# EAGLE design primary_teensy (EAGLE 6.1)
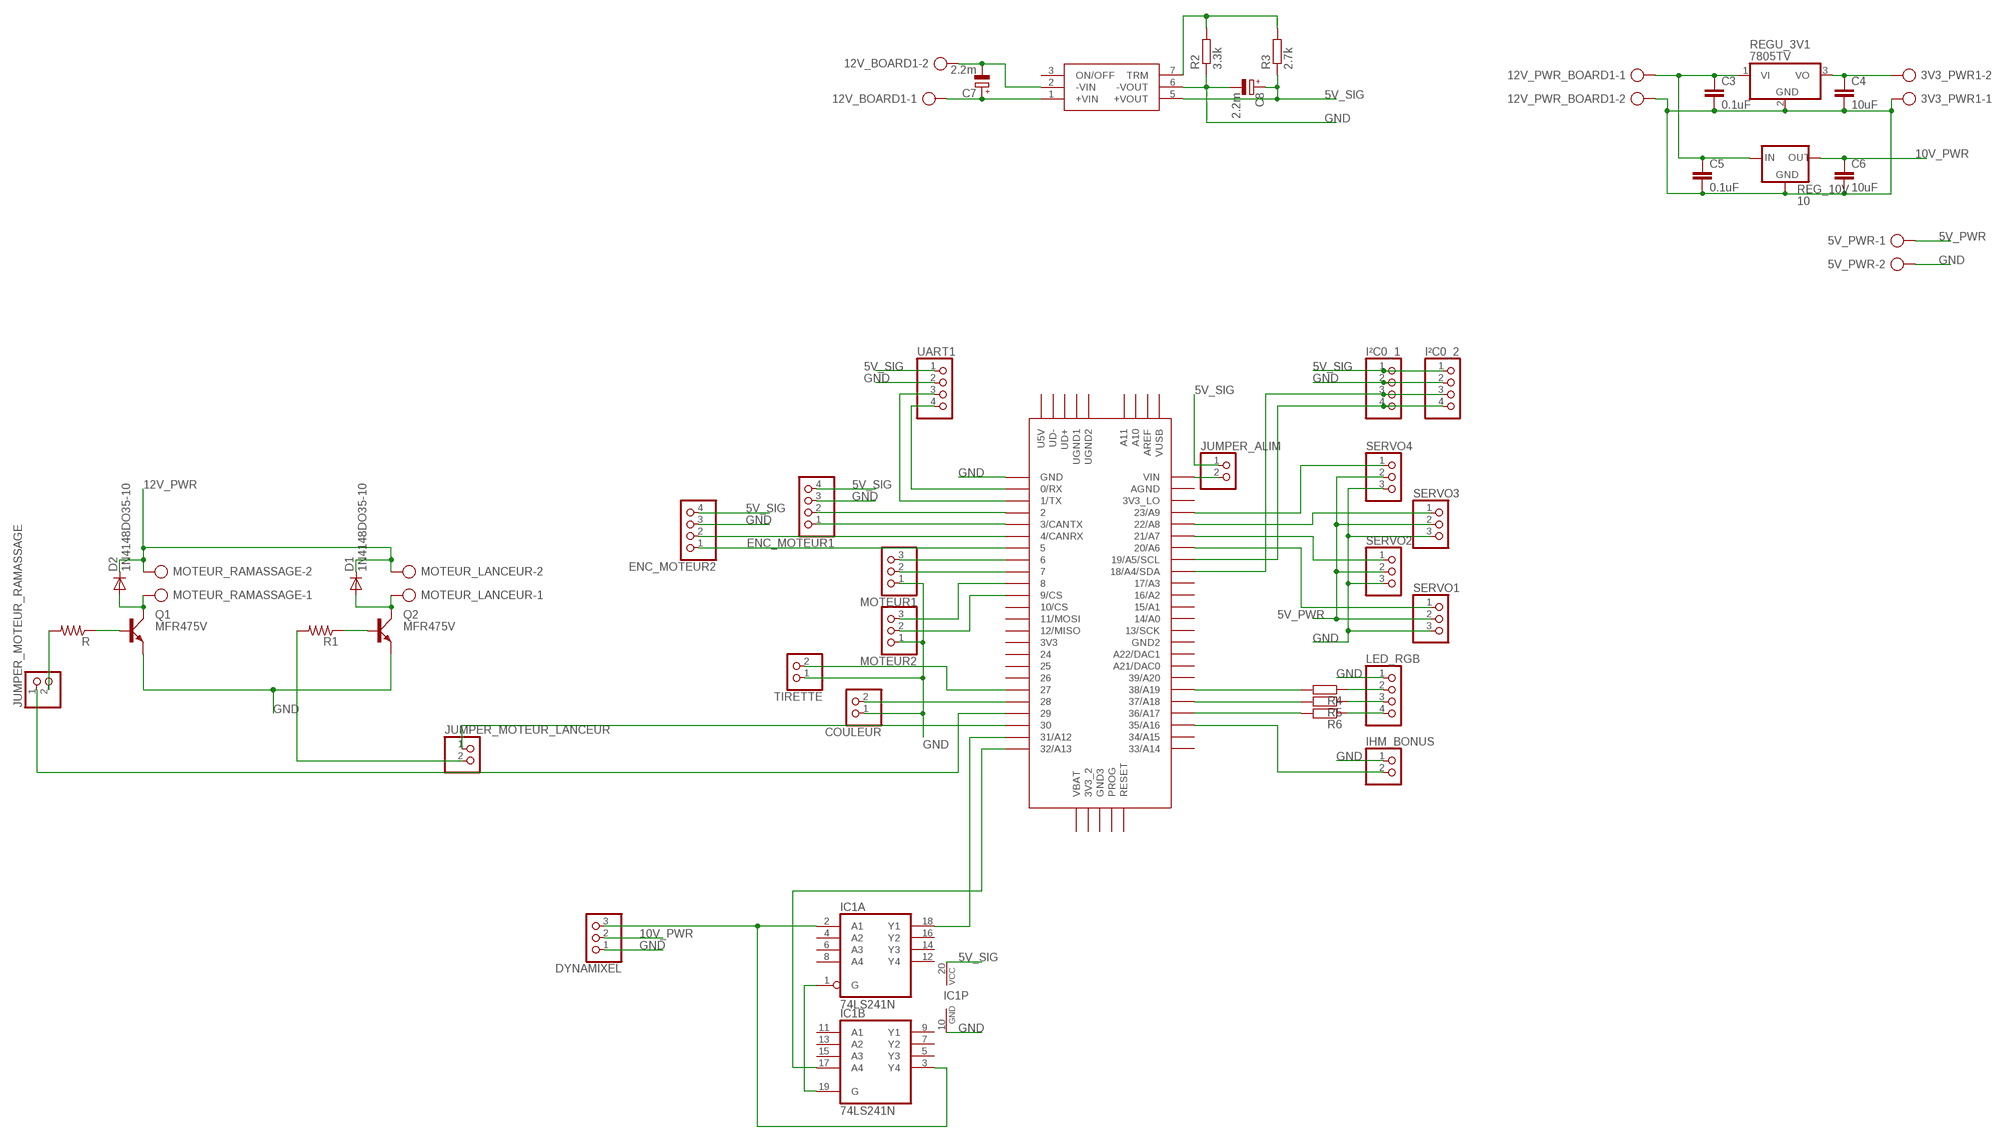
[diagram p0: schematic, sheet 1]

## Parts
3V3_PWR1  AK300/2  [AK300/2]
5V_PWR  AK300/2  [AK300/2]
12V_BOARD1  AK300/2  [AK300/2]
12V_PWR_BOARD1  AK300/2  [AK300/2]
C3  0.1uF  C-EU050-025X075  [C050-025X075]
C4  10uF  C-EU050-025X075  [C050-025X075]
C5  0.1uF  C-EU050-025X075  [C050-025X075]
C6  10uF  C-EU050-025X075  [C050-025X075]
C7  2.2m  CPOL-EUE5-13  [E5-13]
C8  2.2m  CPOL-EUE5-13  [E5-13]
COULEUR  PINHD-1X2  [1X02]
D1  1N4148DO35-10  [DO35-10]
D2  1N4148DO35-10  [DO35-10]
DYNAMIXEL  PINHD-1X3  [1X03]
ENC_MOTEUR1  PINHD-1X4  [1X04]
ENC_MOTEUR2  PINHD-1X4  [1X04]
IC1  74LS241N  [DIL20]
IHM_BONUS  PINHD-1X2  [1X02]
I²C0_1  PINHD-1X4  [1X04]
I²C0_2  PINHD-1X4  [1X04]
JUMPER_ALIM  PINHD-1X2  [1X02]
JUMPER_MOTEUR_LANCEUR  PINHD-1X2  [1X02]
JUMPER_MOTEUR_RAMASSAGE  PINHD-1X2  [1X02]
LED_RGB  PINHD-1X4  [1X04]
MOTEUR1  PINHD-1X3  [1X03]
MOTEUR2  PINHD-1X3  [1X03]
MOTEUR_LANCEUR  AK300/2  [AK300/2]
MOTEUR_RAMASSAGE  AK300/2  [AK300/2]
Q1  MFR475V  [TO220AV]
Q2  MFR475V  [TO220AV]
R  RESISTORAXIAL-0.3  [AXIAL-0.3]
R1  RESISTORAXIAL-0.3  [AXIAL-0.3]
R2  3.3k  R-EU_0207/7  [0207/7]
R3  2.7k  R-EU_0207/7  [0207/7]
R4  R-EU_0207/7  [0207/7]
R5  R-EU_0207/7  [0207/7]
R6  R-EU_0207/7  [0207/7]
REG_10V  10  78XXS  [78XXS]
REGU_3V1  7805TV  [TO220V]
SERVO1  PINHD-1X3  [1X03]
SERVO2  PINHD-1X3  [1X03]
SERVO3  PINHD-1X3  [1X03]
SERVO4  PINHD-1X3  [1X03]
TIRETTE  PINHD-1X2  [1X02]
U$1  TEENSY_3.5/3.6  [TEENSY_3.5/3.6]
U$3  TEN25-1211TEN25-1211  [TEN25]
UART1  PINHD-1X4  [1X04]

## Nets
3V3: 3V3_PWR1.2 C4.1 REGU_3V1.3(VO)
5V_PWR: 5V_PWR.1 SERVO1.2 SERVO2.2 SERVO3.2 SERVO4.2
5V_SIG: C8.+ ENC_MOTEUR1.4 ENC_MOTEUR2.4 IC1.20(P:VCC) I²C0_1.1 I²C0_2.1 JUMPER_ALIM.1 R3.1 U$3.5(+VOUT) UART1.1
10V_PWR: C6.1 DYNAMIXEL.2 REG_10V.OUT
12V_PWR: 12V_PWR_BOARD1.1 C3.1 C5.1 D1.C D2.C MOTEUR_LANCEUR.2 MOTEUR_RAMASSAGE.2 REG_10V.IN REGU_3V1.1(VI)
+12V: 12V_BOARD1.1 C7.+ U$3.1(+VIN)
ENC_MOT1_A: ENC_MOTEUR1.2 U$1.2
ENC_MOT1_B: ENC_MOTEUR1.1 U$1.3/CANTX
ENC_MOT2_A: ENC_MOTEUR2.2 U$1.4/CANRX
ENC_MOT2_B: ENC_MOTEUR2.1 U$1.5
GND: 3V3_PWR1.1 5V_PWR.2 12V_PWR_BOARD1.2 C3.2 C4.2 C5.2 C6.2 C8.- COULEUR.1 DYNAMIXEL.1 ENC_MOTEUR1.3 ENC_MOTEUR2.3 IC1.10(P:GND) IHM_BONUS.1 I²C0_1.2 I²C0_2.2 LED_RGB.1 MOTEUR1.1 MOTEUR2.1 Q1.E Q2.E R2.1 REG_10V.GND REGU_3V1.2(GND) SERVO1.3 SERVO2.3 SERVO3.3 SERVO4.3 TIRETTE.1 U$1.GND U$3.6(-VOUT) UART1.2
GND_12: 12V_BOARD1.2 C7.- U$3.2(-VIN)
MOT1_DIR: MOTEUR1.3 U$1.6
MOT1_PWM: MOTEUR1.2 U$1.7
MOT2_DIR: MOTEUR2.3 U$1.8
MOT2_PWM: MOTEUR2.2 U$1.9/CS
MOT_LANCEUR: JUMPER_MOTEUR_LANCEUR.1 U$1.30
MOT_RAMASSAGE: JUMPER_MOTEUR_RAMASSAGE.1 U$1.29
N$1: D2.A MOTEUR_RAMASSAGE.1 Q1.C
N$2: D1.A MOTEUR_LANCEUR.1 Q2.C
N$3: LED_RGB.4 R6.1
N$4: R2.2 R3.2 U$3.7(TRM)
N$5: Q2.B R1.P$1
N$6: Q1.B R.P$1
N$7: LED_RGB.3 R5.1
N$8: JUMPER_MOTEUR_LANCEUR.2 R1.P$2
N$9: JUMPER_MOTEUR_RAMASSAGE.2 R.P$2
N$10: SERVO4.1 U$1.23/A9
N$11: LED_RGB.2 R4.1
N$12: SERVO3.1 U$1.22/A8
N$13: SERVO2.1 U$1.21/A7
N$14: SERVO1.1 U$1.20/A6
N$15: JUMPER_ALIM.2 U$1.VIN
N$16: COULEUR.2 U$1.28
N$17: R4.2 U$1.38/A19
N$18: R5.2 U$1.37/A18
N$19: R6.2 U$1.36/A17
N$20: IHM_BONUS.2 U$1.35/A16
N$39: I²C0_1.3 I²C0_2.3 U$1.18/A4/SDA
N$40: I²C0_1.4 I²C0_2.4 U$1.19/A5/SCL
N$41: TIRETTE.2 U$1.27
N$44: IC1.1(A:G) IC1.19(B:G)
N$45: DYNAMIXEL.3 IC1.2(A:A1) IC1.3(B:Y4)
RX0: U$1.0/RX UART1.4
RX4: IC1.18(A:Y1) U$1.31/A12
TX1: U$1.1/TX UART1.3
TX4: IC1.17(B:A4) U$1.32/A13
Unconnected: IC1.4(A:A2) IC1.5(B:Y3) IC1.6(A:A3) IC1.7(B:Y2) IC1.8(A:A4) IC1.9(B:Y1) IC1.11(B:A1) IC1.12(A:Y4) IC1.13(B:A2) IC1.14(A:Y3) IC1.15(B:A3) IC1.16(A:Y2) U$1.3V3 U$1.3V3_2 U$1.3V3_LO U$1.10/CS U$1.11/MOSI U$1.12/MISO U$1.13/SCK U$1.14/A0 U$1.15/A1 U$1.16/A2 U$1.17/A3 U$1.21/DAC0(A21/DAC0) U$1.24 U$1.25 U$1.26 U$1.33/A14 U$1.34/A15 U$1.39/A20 U$1.A10 U$1.A11 U$1.A22/DAC1 U$1.AGND U$1.AREF U$1.GND2 U$1.GND3 U$1.PROG U$1.RESET U$1.U5V U$1.UD+ U$1.UD- U$1.UGND1 U$1.UGND2 U$1.VBAT U$1.VUSB U$3.3(ON/OFF)

## Library data of the parts
3V3_PWR1 5V_PWR 12V_BOARD1 12V_PWR_BOARD1 MOTEUR_LANCEUR MOTEUR_RAMASSAGE = con-ptr500:AK300/2: CONNECTOR; OC_FARNELL: unknown; OC_NEWARK: unknown
C3-C6 = rcl:C-EU: CAPACITOR, European symbol
C7 C8 = resistor:CPOL-EU: POLARIZED CAPACITOR, European symbol
COULEUR IHM_BONUS JUMPER_ALIM JUMPER_MOTEUR_LANCEUR JUMPER_MOTEUR_RAMASSAGE TIRETTE = pinhead:PINHD-1X2: PIN HEADER
D1 D2 = diode:1N4148: DIODE high speed (Philips)
DYNAMIXEL MOTEUR1 MOTEUR2 SERVO1-SERVO4 = pinhead:PINHD-1X3: PIN HEADER
ENC_MOTEUR1 ENC_MOTEUR2 I²C0_1 I²C0_2 LED_RGB UART1 = pinhead:PINHD-1X4: PIN HEADER
IC1 = 74xx-eu:74*241: Octal BUFFER and LINE DRIVER, 3-state
Q1 Q2 = transistor-power:MFR4*: NPN RF Power Transistor Source: Motorola - MRF475.pdf
R R1 = SparkFun:RESISTOR: Resistor Basic schematic elements and footprints for 0603, 1206, and PTH resistors.
R2-R6 = resistor:R-EU_: RESISTOR, European symbol
REG_10V = v-reg:78XXS: VOLTAGE REGULATOR
REGU_3V1 = linear:78*: Positive VOLTAGE REGULATOR Source: http://cache.national.com/ds/LM/LM78L05.pdf http://www.fairchildsemi.com/ds/LM/LM7805.pdf
U$1 = Teensy356:TEENSY_3.5/3.6
U$3 = tracopower:TEN25-1211

## Board
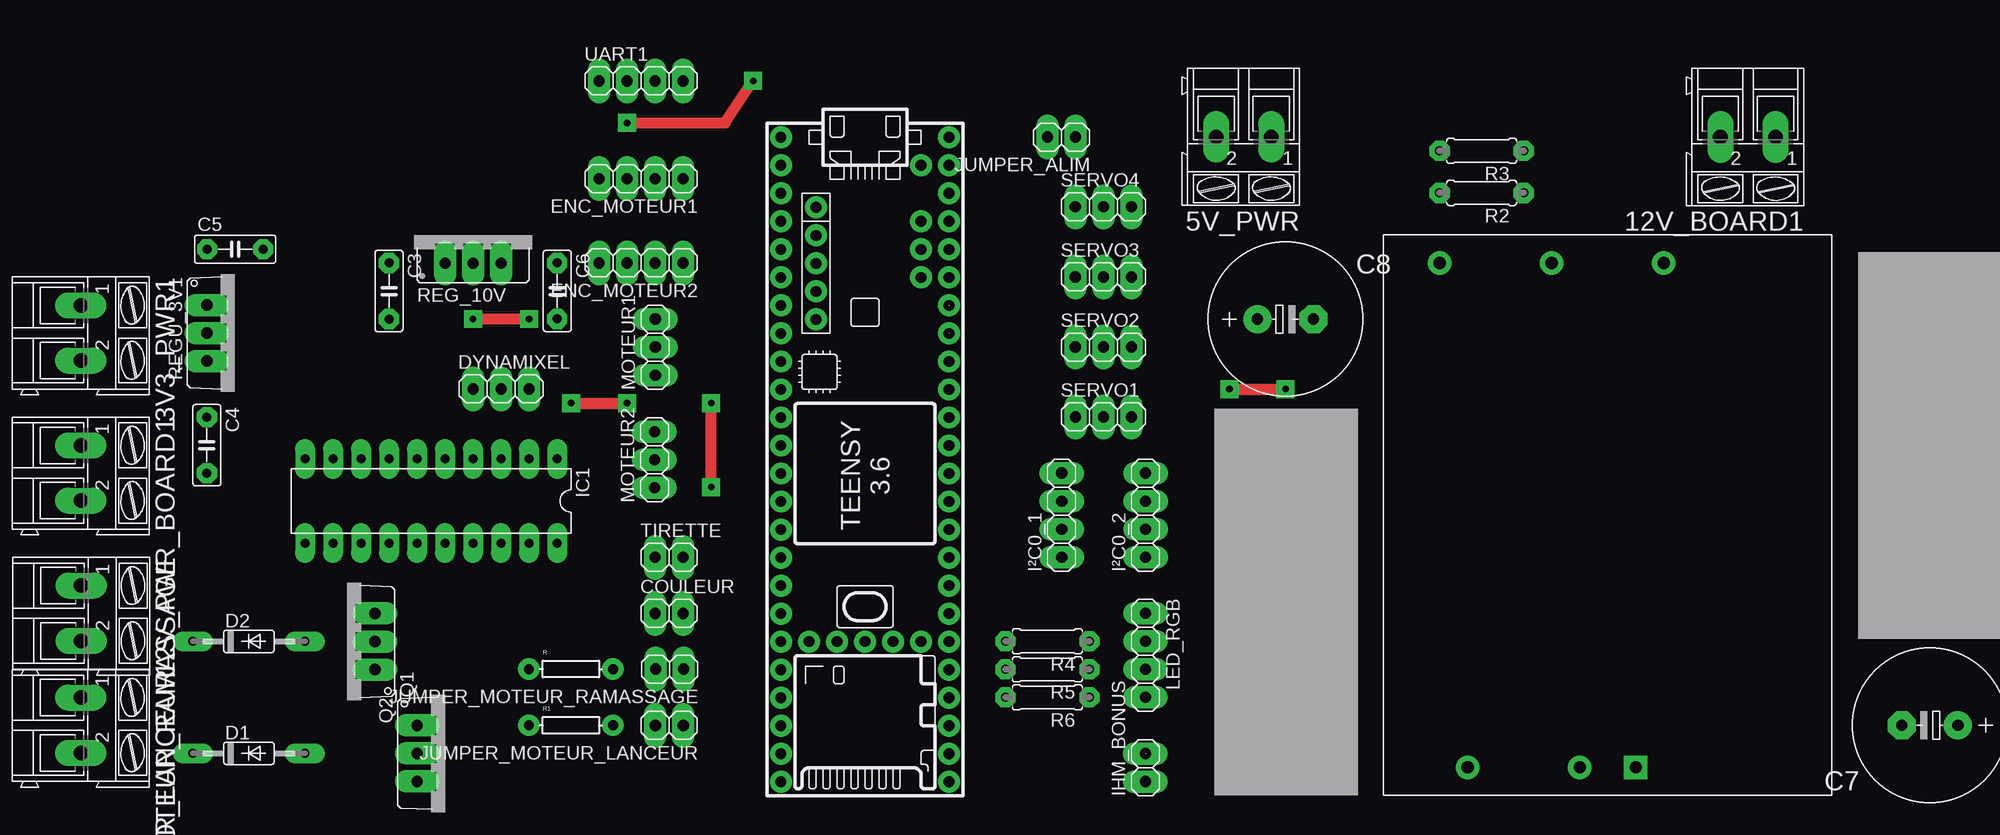
[diagram p1: board, top side]
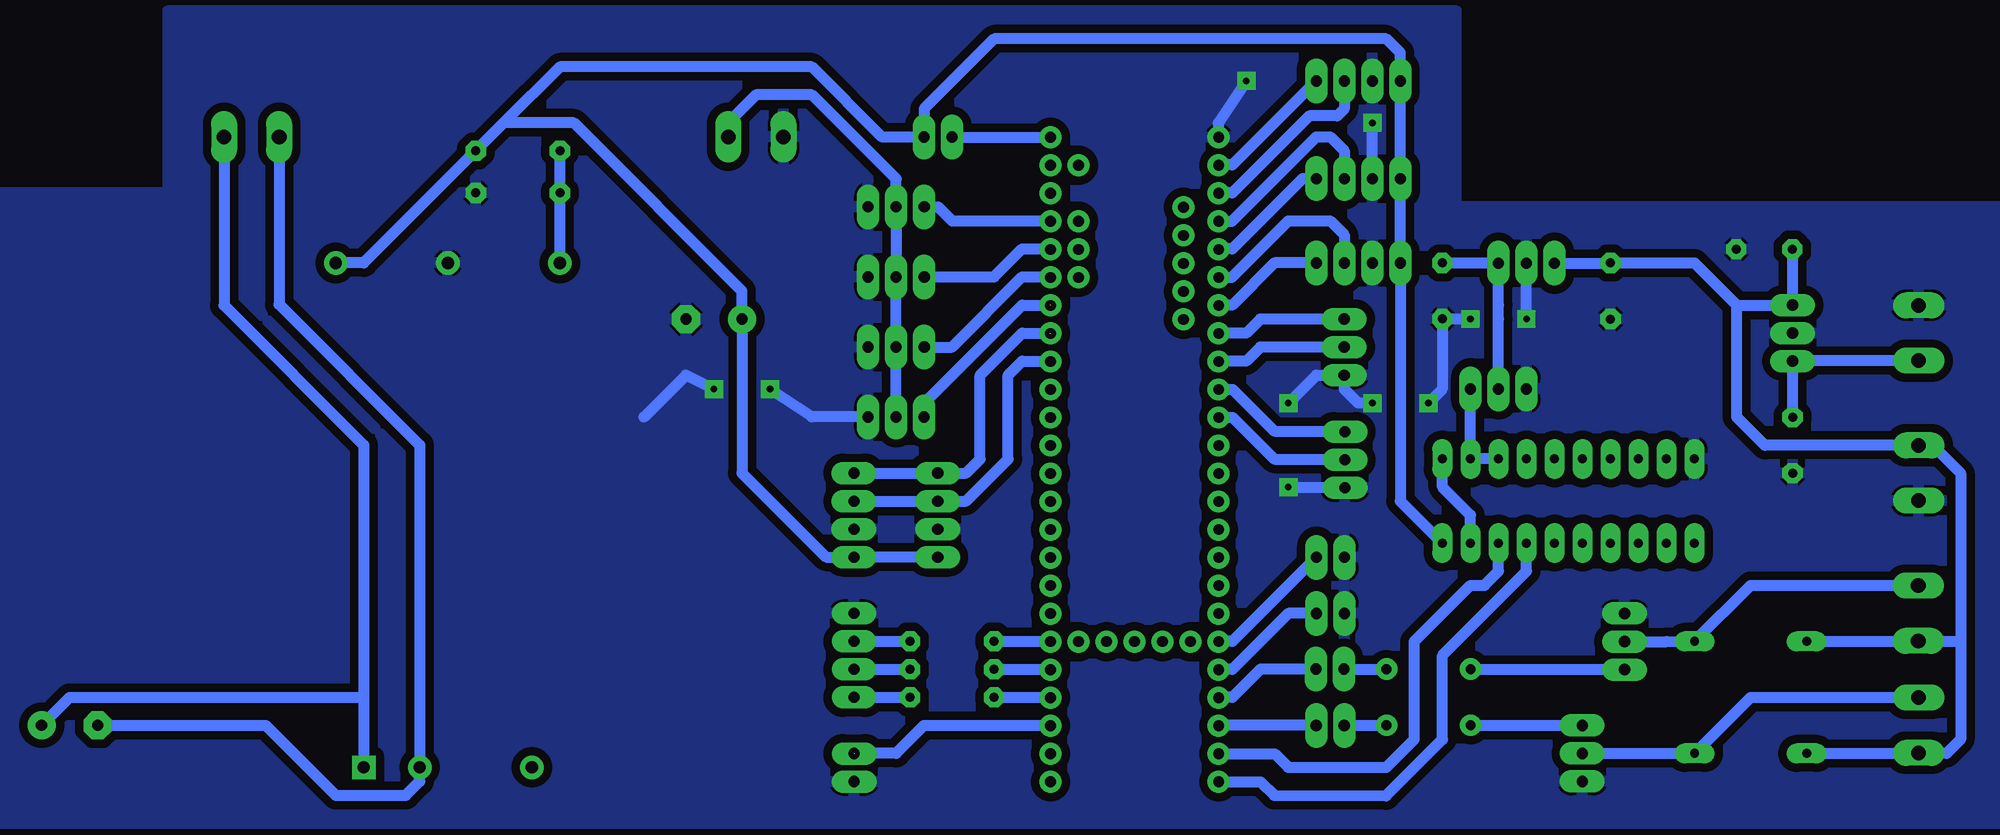
[diagram p2: board, bottom side, seen from below]

No outline drawn. Coordinates in mm, seen from the top.
Copper layers (1*16): Top 0.035mm / dielectric 1.5mm / Bottom 0.035mm
Design rules: minimum track width 10mil, minimum drill 10mil, track to track 30mil, track to pad 30mil, pad to pad 15mil, via to via 15mil, smd to smd 8mil, copper to edge 40mil, drill to drill 8mil, minimum pad ring 15mil, minimum via ring 8mil, stop-mask expansion 4mil, vias tented up to drill 0mil, thermal gap 10mil

### Footprints (pad centres in the part's own frame; a part is rotated, then mirrored left to right if it is on the bottom)
AK300/2 = drill 1.321 long: 1 -2.515,0; 2 2.489,0
C050-025X075 = drill 0.813 octagon: 1 -2.54,0; 2 2.54,0
E5-13 = drill 1.016 pad 2.54: + -2.54,0 | drill 1.016 pad 2.54 octagon: - 2.54,0
1X02 = drill 1.016 long: 1 -1.27,0; 2 1.27,0
DO35-10 = drill 0.813 long: A 5.08,0; C -5.08,0
1X03 = drill 1.016 long: 1 -2.54,0; 2 0,0; 3 2.54,0
1X04 = drill 1.016 long: 1 -3.81,0; 2 -1.27,0; 3 1.27,0; 4 3.81,0
DIL20 = drill 0.813 long: 1 -11.43,-3.81; 2 -8.89,-3.81; 3 -6.35,-3.81; 4 -3.81,-3.81; 5 -1.27,-3.81; 6 1.27,-3.81; 7 3.81,-3.81; 8 6.35,-3.81; 9 8.89,-3.81; 10 11.43,-3.81; 11 11.43,3.81; 12 8.89,3.81; 13 6.35,3.81; 14 3.81,3.81; 15 1.27,3.81; 16 -1.27,3.81; 17 -3.81,3.81; 18 -6.35,3.81; 19 -8.89,3.81; 20 -11.43,3.81
TO220AV = drill 1.016 long: B -2.54,-2.54; C 0,-2.54; E 2.54,-2.54
AXIAL-0.3 = drill 0.9 pad 1.88: P$1 -3.81,0; P$2 3.81,0
0207/7 = drill 0.813 octagon: 1 -3.81,0; 2 3.81,0
78XXS = drill 1.016 long: GND 0,-2.54; IN -2.54,-2.54; OUT 2.54,-2.54
TO220V = drill 1.016 long: 1 -2.54,-2.54; 2 0,-2.54; 3 2.54,-2.54
TEENSY_3.5/3.6 = drill 0.965: 0/RX -25.4,-7.62; 1/TX -22.86,-7.62; 2 -20.32,-7.62; 3/CANTX -17.78,-7.62; 3V3 7.62,-7.62; 3V3_2 17.78,-2.54; 3V3_LO -22.86,7.62; 4/CANRX -15.24,-7.62; 5 -12.7,-7.62; 6 -10.16,-7.62; 7 -7.62,-7.62; 8 -5.08,-7.62; 9/CS -2.54,-7.62; 10/CS 0,-7.62; 11/MOSI 2.54,-7.62; 12/MISO 5.08,-7.62; 13/SCK 5.08,7.62; 14/A0 2.54,7.62; 15/A1 0,7.62; 16/A2 -2.54,7.62; 17/A3 -5.08,7.62; 18/A4/SDA -7.62,7.62; 19/A5/SCL -10.16,7.62; 20/A6 -12.7,7.62; 21/A7 -15.24,7.62; 21/DAC0 12.7,7.62; 22/A8 -17.78,7.62; 23/A9 -20.32,7.62; 24 10.16,-7.62; 25 12.7,-7.62; 26 15.24,-7.62; 27 17.78,-7.62; 28 20.32,-7.62; 29 22.86,-7.62; 30 25.4,-7.62; 31/A12 27.94,-7.62; 32/A13 30.48,-7.62; 33/A14 30.48,7.62; 34/A15 27.94,7.62; 35/A16 25.4,7.62; 36/A17 22.86,7.62; 37/A18 20.32,7.62; 38/A19 17.78,7.62; 39/A20 15.24,7.62; A10 -17.78,5.08; A11 -15.24,5.08; A22/DAC1 10.16,7.62; AGND -25.4,7.62; AREF -20.32,5.08; GND -27.94,-7.62; GND2 7.62,7.62; GND3 17.78,0; PROG 17.78,2.54; RESET 17.78,5.08; U5V -21.59,-4.445; UD+ -16.51,-4.445; UD- -19.05,-4.445; UGND1 -13.97,-4.445; UGND2 -11.43,-4.445; VBAT 17.78,-5.08; VIN -27.94,7.62; VUSB -25.4,5.08
TEN25 = drill 1.1 pad 1.778 square: 1 0,0 | drill 1.1 pad 1.778: 2 0,5.08; 3 0,15.24; 5 45.72,-2.54; 6 45.72,7.62; 7 45.72,17.78

### Placement (x,y rotation side)
3V3_PWR1  1003.3,518.16 270 top
5V_PWR  1108.72,535.95 180 top
12V_BOARD1  1154.43,535.94 180 top
12V_PWR_BOARD1  1003.3,505.46 270 top
C3  1031.24,521.97 270 top
C4  1014.73,508 270 top
C5  1017.29,525.76 0 top
C6  1046.49,521.97 270 top
C7  1170.94,482.6 180 top
C8  1112.52,519.43 0 top
COULEUR  1056.63,492.75 0 top
D1  1018.54,480.06 0 top
D2  1018.54,490.21 0 top
DYNAMIXEL  1041.4,513.1 0 top
ENC_MOTEUR1  1054.09,532.15 180 top
ENC_MOTEUR2  1054.1,524.51 180 top
IC1  1035.05,502.94 180 top
IHM_BONUS  1099.82,478.78 90 top
I²C0_1  1092.23,501.66 90 top
I²C0_2  1099.83,501.66 90 top
JUMPER_ALIM  1092.2,535.92 180 top
JUMPER_MOTEUR_LANCEUR  1056.65,482.6 180 top
JUMPER_MOTEUR_RAMASSAGE  1056.69,487.71 180 top
LED_RGB  1099.82,488.95 270 top
MOTEUR1  1055.38,516.89 90 top
MOTEUR2  1055.31,506.68 90 top
MOTEUR_LANCEUR  1003.3,482.6 270 top
MOTEUR_RAMASSAGE  1003.34,492.74 270 top
Q1  1027.43,490.2 90 top
Q2  1036.34,480.05 270 top
R  1047.73,487.7 0 top
R1  1047.73,482.6 0 top
R2  1130.3,530.86 180 top
R3  1130.3,534.67 180 top
R4  1090.93,490.22 180 top
R5  1090.93,487.68 180 top
R6  1090.93,485.14 180 top
REG_10V  1038.87,527.04 0 top
REGU_3V1  1017.27,518.16 270 top
SERVO1  1096.01,510.56 0 top
SERVO2  1096,516.89 0 top
SERVO3  1096,523.24 0 top
SERVO4  1096,529.6 0 top
TIRETTE  1056.63,497.83 0 top
U$1  1074.4,507.97 270 top
U$3  1144.27,478.79 90 top
UART1  1054.11,541.01 0 top

### Tracks (layer width: path | path; a pad name or v marks a point on that pad's centre or on a via)
3V3
  Bottom 1.016: 3V3_PWR1.2 1014.68,515.67 REGU_3V1.3 C4.1
5V_PWR  (1 unrouted)
  Bottom 1.016: 5V_PWR.1 1111.25,535.97 1111.25,537.21 1108.71,539.75 1103.63,539.75 1096,532.12 SERVO4.2 SERVO3.2 | SERVO1.2 SERVO2.2 SERVO3.2
5V_SIG
  Bottom 1.016: IC1.20 1050.28,502.92 1050.29,502.92 ENC_MOTEUR2.4 ENC_MOTEUR1.4 UART1.1 1050.3,543.57 1051.56,544.83 1087.12,544.83 1093.47,538.48 JUMPER_ALIM.1 1097.26,535.92 1103.63,542.29 1126.49,542.29 1131.57,537.21 | 1131.57,537.21 1125.22,537.21 1109.98,521.97 C8.+ 1109.98,505.46 1102.36,497.84 I²C0_2.1 I²C0_1.1 | 1131.57,537.21 R3.1 1144.27,524.51 U$3.5
10V_PWR  (1 unrouted)
  Bottom 1.016: DYNAMIXEL.2 1041.4,519.43 1041.4,520.7 REG_10V.OUT 1046.47,524.5 C6.1
12V_PWR
  Bottom 1.016: D1.C 1003.35,480.06 MOTEUR_LANCEUR.2 1003.25,480.06 1000.76,480.06 999.49,481.33 999.49,490.22 | D2.C 1003.38,490.21 | 1003.38,490.21 MOTEUR_RAMASSAGE.2 | 999.49,490.22 999.49,505.46 1002,507.98 12V_PWR_BOARD1.1 1017.25,507.98 1019.81,510.54 1019.81,520.7 | 1003.38,490.21 999.5,490.21 999.49,490.22 | REG_10V.IN 1031.25,524.5 C3.1 1023.62,524.51 1019.81,520.7 | C5.1 1014.75,520.72 REGU_3V1.1 1019.81,520.7
+12V
  Bottom 1.016: 12V_BOARD1.1 1156.94,520.67 1144.27,508 1144.27,485.14 | 1144.27,485.14 U$3.1 | C7.+ 1170.94,485.14 1144.27,485.14
ENC_MOT1_A  (1 unrouted)
  Bottom 1.016: U$1.2 1065.56,528.29 1057.91,535.94 1056.64,535.94 1055.37,534.67 1055.37,532.13
ENC_MOT1_B
  Bottom 1.016: ENC_MOTEUR1.1 1059.16,532.15 1065.53,525.78 1066.74,525.78 U$1.3/CANTX
ENC_MOT2_A
  Bottom 1.016: U$1.4/CANRX 1065.56,523.21 1060.45,528.32 1056.64,528.32 1055.37,527.05 ENC_MOTEUR2.2
ENC_MOT2_B
  Bottom 1.016: ENC_MOTEUR2.1 1061.72,524.51 1065.53,520.7 1066.74,520.7 U$1.5
GND  (via drill 0.6)
  Top 1.016: v1060.45,504.19 v1060.45,511.81 | v1043.94,519.43 v1038.86,519.43 | v1047.75,511.81 v1052.83,511.81 | v1107.44,513.08 v1112.52,513.08 | v1052.83,537.21 1061.72,537.21 v1064.26,541.02
  Bottom 1.016: MOTEUR2.1 1060.39,504.13 v1060.45,504.19 | v1060.45,511.81 1057.91,514.35 MOTEUR1.1 1055.37,514.34 1055.37,513.08 1054.1,511.81 v1052.83,511.81 | v1043.94,519.43 C6.2 1046.49,513.07 v1047.75,511.81 | v1038.86,519.43 REG_10V.GND | SERVO1.3 1103.65,510.56 v1107.44,513.08 | v1112.52,513.08 1115.06,514.35 1118.87,510.54 | ENC_MOTEUR1.3 v1052.83,537.21 | v1064.26,541.02 1066.8,537.21 U$1.GND
  pour Bottom: 1181.1,473.71 995.68,473.71 995.68,529.59 1045.21,529.59 1045.21,547.37 1162.05,547.37 1162.05,530.86 1178.56,530.86 1181.1,530.86
GND_12
  Bottom 1.016: 12V_BOARD1.2 1151.94,520.75 1139.19,508 U$3.2 1139.19,477.52 1140.46,476.25 1146.81,476.25 1153.16,482.6 C7.-
MOT1_DIR
  Bottom 1.016: MOTEUR1.3 1062.99,519.43 1064.26,518.16 1066.74,518.16 U$1.6
MOT1_PWM
  Bottom 1.016: MOTEUR1.2 1062.99,516.89 1064.26,515.62 1066.74,515.62 U$1.7
MOT2_DIR
  Bottom 1.016: U$1.8 1065.5,513.05 1061.72,509.27 1055.36,509.27 MOTEUR2.3
MOT2_PWM
  Bottom 1.016: U$1.9/CS 1065.5,510.51 1061.72,506.73 1055.36,506.73 MOTEUR2.2
MOT_LANCEUR
  Bottom 1.016: JUMPER_MOTEUR_LANCEUR.1 1066.75,482.6 U$1.30
MOT_RAMASSAGE
  Bottom 1.016: JUMPER_MOTEUR_RAMASSAGE.1 1062.96,487.7 1065.53,485.14 1066.74,485.14 U$1.29
N$1
  Bottom 1.016: Q1.C 1026.17,490.2 D2.A 1023.62,490.22 1018.54,495.3 1003.38,495.3 MOTEUR_RAMASSAGE.1
N$2
  Bottom 1.016: Q2.C 1026.17,480.06 D1.A 1018.54,485.14 1003.33,485.14 MOTEUR_LANCEUR.1
N$3
  Bottom 1.016: LED_RGB.4 R6.1
N$4
  Bottom 1.016: U$3.7 R2.2 R3.2
N$5
  Bottom 1.016: R1.P$1 1033.81,482.6 Q2.B
N$6
  Bottom 1.016: R.P$1 1030.01,487.7 Q1.B
N$7
  Bottom 1.016: LED_RGB.3 R5.1
N$8
  Bottom 1.016: JUMPER_MOTEUR_LANCEUR.2 R1.P$2
N$9
  Bottom 1.016: JUMPER_MOTEUR_RAMASSAGE.2 R.P$2 | R.P$2
N$10
  Bottom 1.016: SERVO4.1 1092.21,529.6 1090.93,528.32 1082.05,528.32 U$1.23/A9
N$11
  Bottom 1.016: LED_RGB.2 R4.1
N$12
  Bottom 1.016: SERVO3.1 1087.12,523.24 1084.58,525.78 1082.05,525.78 U$1.22/A8
N$13
  Bottom 1.016: SERVO2.1 1090.93,516.89 1084.58,523.24 1082.05,523.24 U$1.21/A7
N$14  (1 unrouted)
  Bottom 1.016: SERVO1.1 1093.47,511.81 1084.58,520.7 1082.04,520.7
N$15
  Bottom 1.016: JUMPER_ALIM.2 1082.03,535.92 U$1.VIN
N$16
  Bottom 1.016: COULEUR.2 1060.46,492.75 1065.53,487.68 1066.74,487.68 U$1.28
N$17
  Bottom 1.016: R4.2 1082.05,490.22 U$1.38/A19
N$18
  Bottom 1.016: U$1.37/A18 1087.09,487.65 R5.2
N$19
  Bottom 1.016: R6.2 1082.05,485.14 U$1.36/A17
N$20  (1 unrouted)
  Bottom 1.016: U$1.35/A16 1093.5,482.57 1096.01,480.06 IHM_BONUS.2
N$39
  Bottom 1.016: I²C0_2.3 I²C0_1.3 1089.65,502.93 1085.85,506.73 1085.85,514.35 1084.58,515.62 1082.05,515.62 U$1.18/A4/SDA
N$40  (1 unrouted)
  Bottom 1.016: I²C0_2.4 I²C0_1.4 1089.65,505.46 1088.39,506.73 1088.39,514.35 1084.58,518.16 1082.04,518.16
N$41
  Bottom 1.016: TIRETTE.2 1057.92,497.83 1065.53,490.22 1066.74,490.22 U$1.27
N$44
  Bottom 1.016: IC1.19 1043.94,501.65 1046.48,504.19 IC1.1
N$45
  Bottom 1.016: IC1.3 IC1.2 DYNAMIXEL.3
RX0
  Bottom 1.016: UART1.4 1059.18,539.75 1065.53,533.4 1066.74,533.4 U$1.0/RX
RX4
  Bottom 1.016: U$1.31/A12 1061.69,480.03 1060.45,478.79 1051.56,478.79 1049.02,481.33 1049.02,490.22 1043.94,495.3 1042.67,495.3 1041.4,496.57 IC1.18
TX1
  Bottom 1.016: UART1.3 1055.38,538.48 1056.01,537.85 1058.55,537.85 1065.53,530.86 1066.74,530.86 U$1.1/TX
TX4
  Bottom 1.016: U$1.32/A13 1062.96,477.49 1061.72,476.25 1051.59,476.22 1046.48,481.33 1046.48,488.95 1038.86,496.57 IC1.17